# EAGLE design CHAIRI2C (EAGLE 9.6.2)
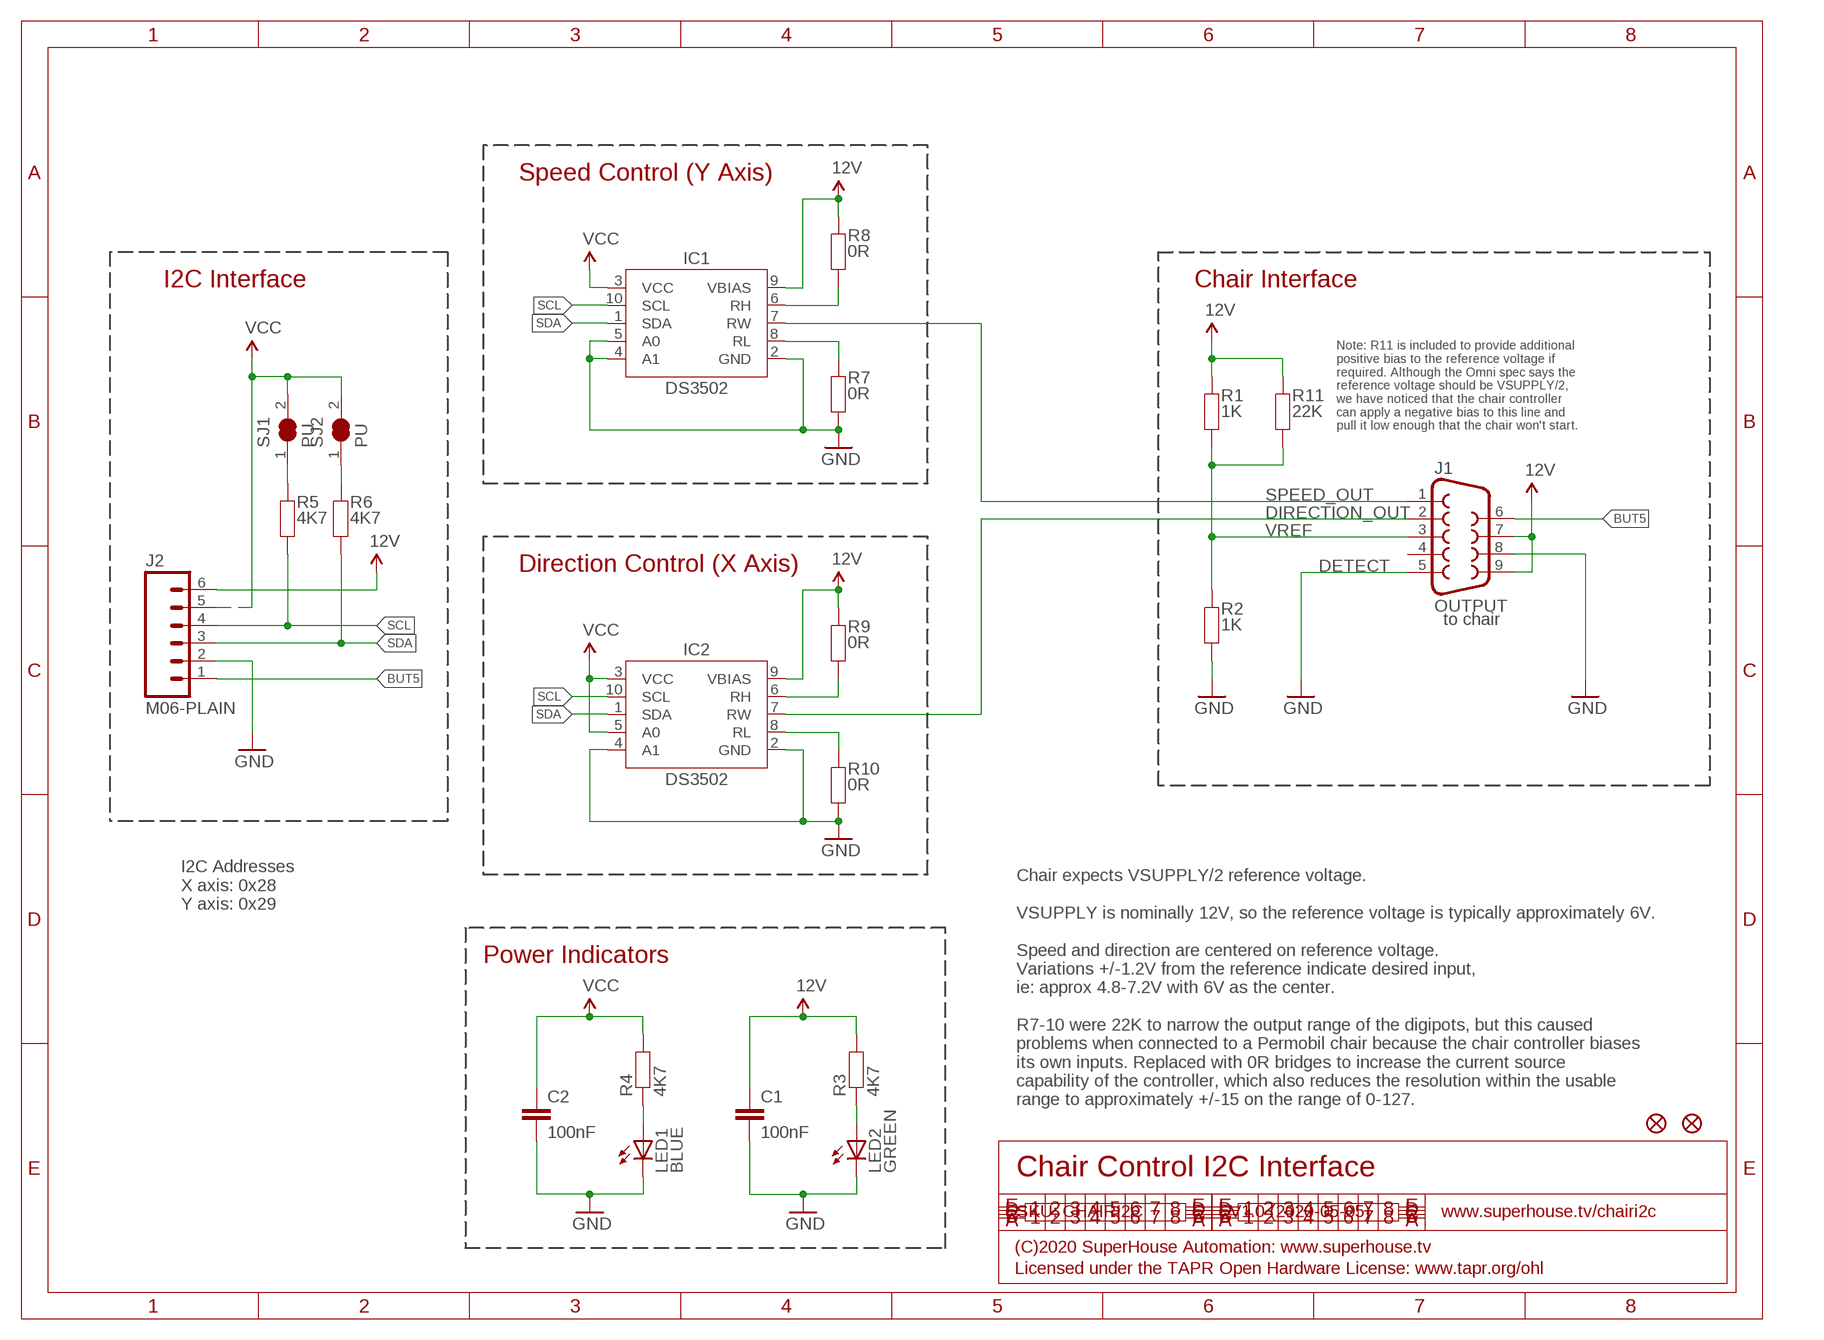
[diagram p0: schematic, sheet 1]

## Parts
C1  100nF  CAP0603  [C0603]
C2  100nF  CAP0603  [C0603]
FID1  FIDUCIAL1X2.5  [FIDUCIAL-1X2.5]
FID2  FIDUCIAL1X2.5  [FIDUCIAL-1X2.5]
IC1  DS3502  [MSOP10]
IC2  DS3502  [MSOP10]
J1  OUTPUT  DB9-PCB-SOCKET  [DB9-PCB-SOCKET]
J2  M06-PLAIN  [1X06]
LED1  BLUE  LED0603  [LED-0603]
LED2  GREEN  LED0603  [LED-0603]
R1  1K  RESISTOR0603  [R0603]
R2  1K  RESISTOR0603  [R0603]
R3  4K7  RESISTOR0603  [R0603]
R4  4K7  RESISTOR0603  [R0603]
R5  4K7  RESISTOR0603  [R0603]
R6  4K7  RESISTOR0603  [R0603]
R7  0R  RESISTOR0603  [R0603]
R8  0R  RESISTOR0603  [R0603]
R9  0R  RESISTOR0603  [R0603]
R10  0R  RESISTOR0603  [R0603]
R11  22K  RESISTOR0603  [R0603]
SJ1  PU  SJC-NORMAL  [SJC]
SJ2  PU  SJC-NORMAL  [SJC]

## Nets
12V: C1.1 IC1.9(VBIAS) IC2.9(VBIAS) J1.7 J1.9 J2.6 R1.2 R3.2 R8.2 R9.2 R11.2
BUT5: J1.6 J2.1
DIRECTION_OUT: IC2.7(RW) J1.2
GND: C1.2 C2.2 IC1.2(GND) IC1.4(A1) IC1.5(A0) IC2.2(GND) IC2.4(A1) J1.5 J1.8 J2.2 LED1.C LED2.C R2.1 R7.1 R10.1
N$1: R5.2 SJ1.1
N$2: IC1.6(RH) R8.1
N$3: IC2.6(RH) R9.1
N$4: IC1.8(RL) R7.2
N$5: LED1.A R4.1
N$6: LED2.A R3.1
N$8: R6.2 SJ2.1
N$15: IC2.8(RL) R10.2
SCL: IC1.10(SCL) IC2.10(SCL) J2.4 R5.1
SDA: IC1.1(SDA) IC2.1(SDA) J2.3 R6.1
SPEED_OUT: IC1.7(RW) J1.1
VCC: C2.1 IC1.3(VCC) IC2.3(VCC) IC2.5(A0) J2.5 R4.2 SJ1.2 SJ2.2
VREF: J1.3 R1.1 R2.2 R11.1
Unconnected: J1.4

## Notes on the sheet
- Speed Control (Y Axis)
- I2C Interface | Chair Interface
- Note: R11 is included to provide additional
  positive bias to the reference voltage if
  required. Although the Omni spec says the
  reference voltage should be VSUPPLY/2,
  we have noticed that the chair controller
  can apply a negative bias to this line and
  pull it low enough that the chair won't start.
- Direction Control (X Axis) | DETECT
- to chair
- I2C Addresses
  X axis: 0x28
  Y axis: 0x29
- Power Indicators
- Chair expects VSUPPLY/2 reference voltage.
  
  VSUPPLY is nominally 12V, so the reference voltage is typically approximately 6V.
  
  Speed and direction are centered on reference voltage.
  Variations +/-1.2V from the reference indicate desired input,
  ie: approx 4.8-7.2V with 6V as the center.
  
  R7-10 were 22K to narrow the output range of the digipots, but this caused
  problems when connected to a Permobil chair because the chair controller biases
  its own inputs. Replaced with 0R bridges to increase the current source
  capability of the controller, which also reduces the resolution within the usable
  range to approximately +/-15 on the range of 0-127.
- Chair Control I2C Interface
- SKU: CHAIRI2C | V1.0 (2020-05-05) | www.superhouse.tv/chairi2c
- (C)2020 SuperHouse Automation: www.superhouse.tv
- Licensed under the TAPR Open Hardware License: www.tapr.org/ohl

## Library data of the parts
C1 C2 = SuperHouse-DiscreteSemi:CAP: Capacitor Standard ceramic capacitor
FID1 FID2 = SuperHouse-Symbols:FIDUCIAL: Fiducial Alignment Points Various fiducial points for machine vision alignment.
IC1 IC2 = SuperHouse-ICs:DS3502: DS3502 I2C digital potentiometer
J1 = SuperHouse-Connectors:DB9: DB9 Connector
J2 = SuperHouse-Connectors:M06: 6-way header Standard 1x6 header, and screw terminal variations
LED1 LED2 = SuperHouse-LEDs:LED: LEDs Standard schematic elements and footprints for 5mm, 3mm, 1206, and 0603 sized LEDs. 5mm - Spark Fun Electronics SKU : COM-00529 (and others)
R1-R11 = SuperHouse-DiscreteSemi:RESISTOR: Resistor Standard resistors.
SJ1 SJ2 = SuperHouse-Jumpers:SJC: Solder jumper. Normally closed: does not need solder to close. Can be opened by cutting the track.

## Board
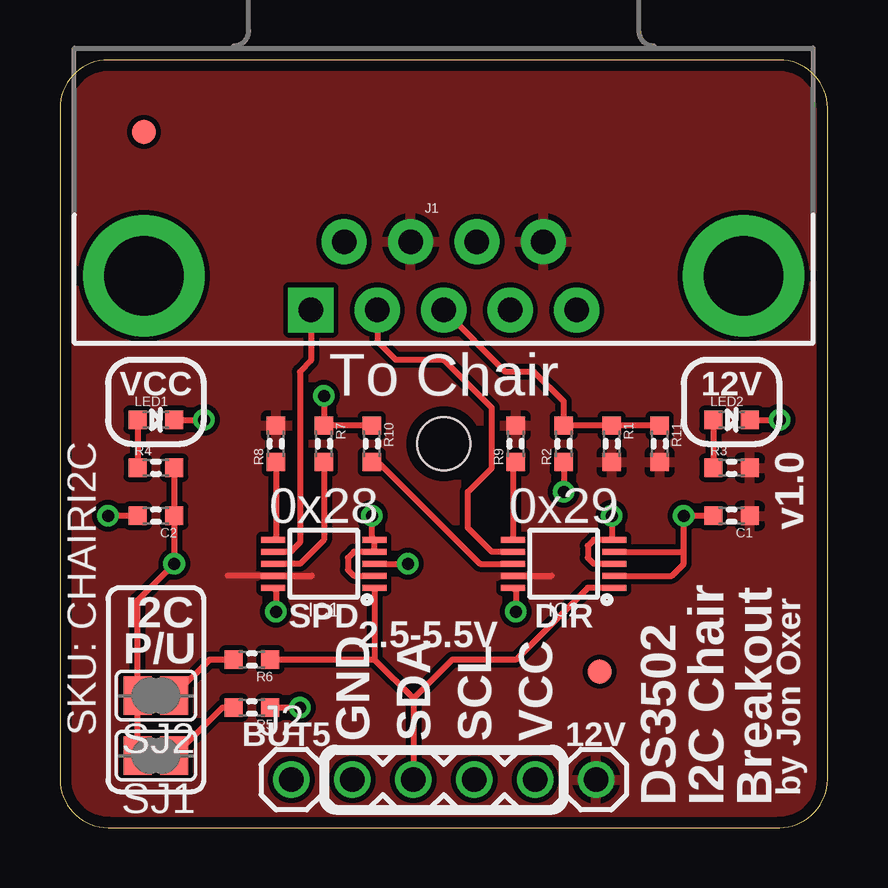
[diagram p1: board, top side]
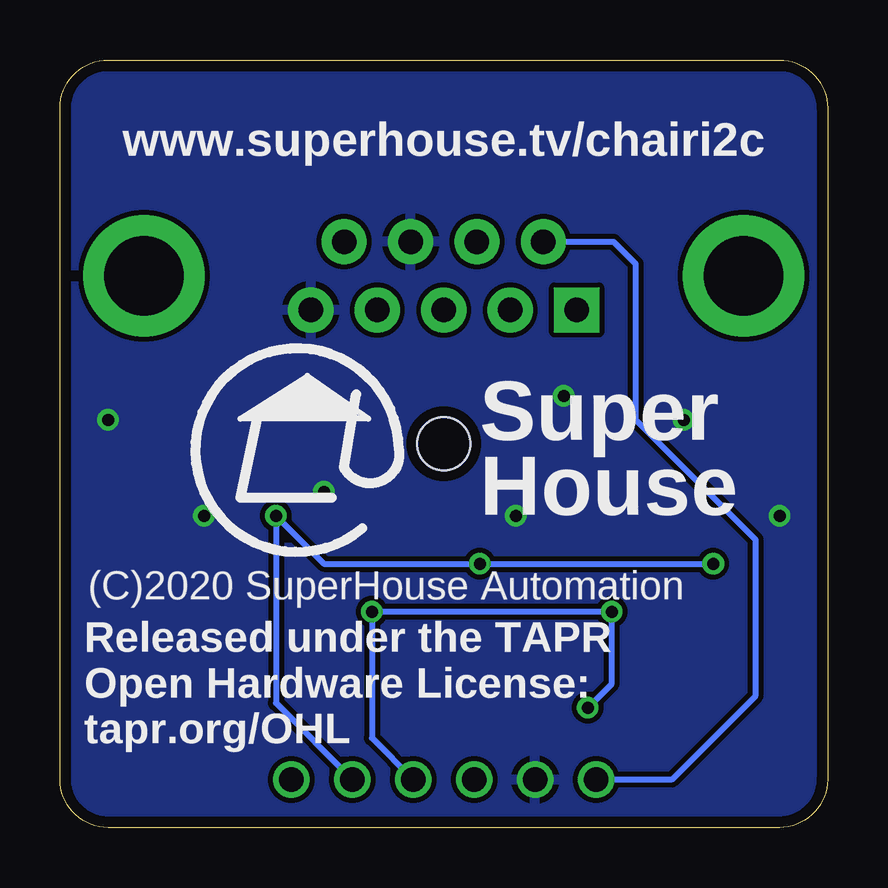
[diagram p2: board, bottom side, seen from below]

Size 32 x 32 mm. Coordinates in mm from the lower left corner, seen from the top.
Outline: 32,2 32,30 arc90 30,32 2,32 arc90 0,30 0,2 arc90 2,0 30,0 arc90 32,2
Copper layers (1*16): Top 0.035mm / dielectric 1.5mm / Bottom 0.035mm
Design rules "SuperHouse-Design-Rules": minimum track width 10mil, minimum drill 24mil, track to track 8mil, track to pad 8mil, pad to pad 8mil, via to via 8mil, smd to smd 6mil, copper to edge 18mil, drill to drill 8mil, minimum pad ring 7mil, minimum via ring 8mil, stop-mask expansion 4mil, vias tented up to drill 0.5mm, thermal gap 10mil
Holes 2.2 mm at 16,16

### Footprints (pad centres in the part's own frame; a part is rotated, then mirrored left to right if it is on the bottom)
C0603 = smd 0.762 x 0.762: 1 -0.762,0; 2 0.762,0
FIDUCIAL-1X2.5 = smd 1 x 1: 1 0,0
MSOP10 = smd 1 x 0.25: 1 -2.113,1; 2 -2.113,0.5; 3 -2.113,0; 4 -2.113,-0.5; 5 -2.113,-1; 6 2.113,-1; 7 2.113,-0.5; 8 2.113,0; 9 2.113,0.5; 10 2.113,1
DB9-PCB-SOCKET = drill 1.016 pad 1.88 square: 1 -5.54,-1.42 | drill 1.016 pad 1.88: 2 -2.77,-1.42; 3 0,-1.42; 4 2.77,-1.42; 5 5.54,-1.42; 6 -4.15,1.42; 7 -1.38,1.42; 8 1.38,1.42; 9 4.15,1.42 | drill 3.302 pad 5.08: G1 -12.5,0; G2 12.5,0
1X06 = drill 1.016: 1 -6.35,0; 2 -3.81,0; 3 -1.27,0; 4 1.27,0; 5 3.81,0; 6 6.35,0
LED-0603 = smd 0.762 x 0.762: A -0.762,0; C 0.762,0
R0603 = smd 0.762 x 0.762: 1 -0.762,0; 2 0.762,0
SJC = smd 1.168 x 1.6: 1 -0.762,0; 2 0.762,0

### Placement (x,y rotation side)
C1  28,13 180 top
C2  4,13 180 top
FID1  3.5,29 0 top
FID2  22.5,6.5 0 top
IC1  11,11 180 top
IC2  21,11 180 top
J1  16,23 0 top
J2  16,2 0 top
LED1  4,17 0 top
LED2  28,17 0 top
R1  23,16 270 top
R2  21,16 90 top
R3  28,15 0 top
R4  4,15 0 top
R5  8,5 180 top
R6  8,7 180 top
R7  22K  [R0603]  11,16 270 top
R8  22K  [R0603]  9,16 90 top
R9  22K  [R0603]  19,16 90 top
R10  22K  [R0603]  13,16 270 top
R11  25,16 270 top
SJ1  4,3 180 top
SJ2  4,5.5 180 top

### Tracks (layer width: path | path; a pad name or v marks a point on that pad's centre or on a via)
12V
  Top 0.254: 7,10.5 IC1.9 10.5,10.5 | IC2.9 20.5,10.5
  pour Top: 32,32 32,0 0,0 0,32
BUT5
  Bottom 0.254: J1.6 8.92,24.42 8,23.5 8,17 3,12 3,5.5 6.5,2 J2.1
DIRECTION_OUT
  Top 0.254: J1.2 13.23,20.27 14,19.5 16,19.5 18,17.5 18,15 17,14 17,12.5 18,11.5 IC2.7
GND  (via drill 0.5)
  Top 0.254: R2.1 v21,14 | LED2.C v30,17 | C1.2 v26,13 26,11.5 | LED1.C v6,17 | C2.2 v2,13 | IC2.2 25.5,10.5 26,11 26,11.5 | IC2.4 26,11.5 | v11,18 R7.1 R10.1 | v13,13 13,12.11 IC1.5 IC1.4 12.25,11.5 12,11.25 12,10.75 12.25,10.5 IC1.2
  pour Bottom: 32,32 32,0 0,0 0,32
N$1
  Top 0.254: R5.2 6.76,5 SJ1.1
N$2
  Top 0.254: R8.1 9,12.11 IC1.6
N$3
  Top 0.254: R9.1 18.89,15.12 IC2.6
N$4
  Top 0.254: R7.2 11,12 10,11 IC1.8
N$5
  Top 0.254: LED1.A R4.1
N$6
  Top 0.254: LED2.A R3.1
N$8
  Top 0.254: R6.2 6.24,7 4.76,5.52 SJ2.1
N$15
  Top 0.254: R10.2 13.26,15.24 17.5,11 IC2.8
SCL  (via drill 0.5)
  Top 0.254: IC2.10 19,9.89 v19,9 | IC1.10 9,9.89 v9,9 | v10,5 R5.1
  Bottom 0.254: v10,5 9,6 v9,9 v19,9 19,3.73 J2.4
SDA
  Top 0.254: 13.11,7 R6.1 | IC1.1 13.11,7 | IC2.1 22,10 19,7 16.35,7 14.73,5.38 | 14.73,5.38 13.11,7 | 14.73,5.38 J2.3
SPEED_OUT
  Top 0.254: J1.1 10.46,19.46 10,19 10,11.88 9.62,11.5 IC1.7
VCC  (via drill 0.5)
  Top 0.254: R4.2 C2.1 v4.76,11 3.24,9.48 SJ2.2 SJ1.2 | IC2.3 22.25,11 22,11.25 22,11.75 22.25,12 23,12 | IC2.5 23,12 | IC1.3 v14.5,11 | v23,13 23,12
  Bottom 0.254: v4.76,11 v14.5,11 21,11 v23,13 23,5.19 J2.5
VREF
  Top 0.254: J1.3 18.58,19 19.76,19 21,17.76 R2.2 R1.1 R11.1

### Text on the board
tPlace: VCC | To Chair | 12V | 0x28 | 0x29 | v1.0 | I2C | SPD | 2.5-5.5V | DIR | P/U | SKU: CHAIRI2C | GND | SDA | SCL | VCC | BUT5 | 12V | DS3502 | I2C Chair | Breakout | by Jon Oxer
bPlace: www.superhouse.tv/chairi2c | Super / House | (C)2020 SuperHouse Automation | Released under the TAPR / Open Hardware License: / tapr.org/OHL